# EAGLE schematic cam (EAGLE 9.6.2)
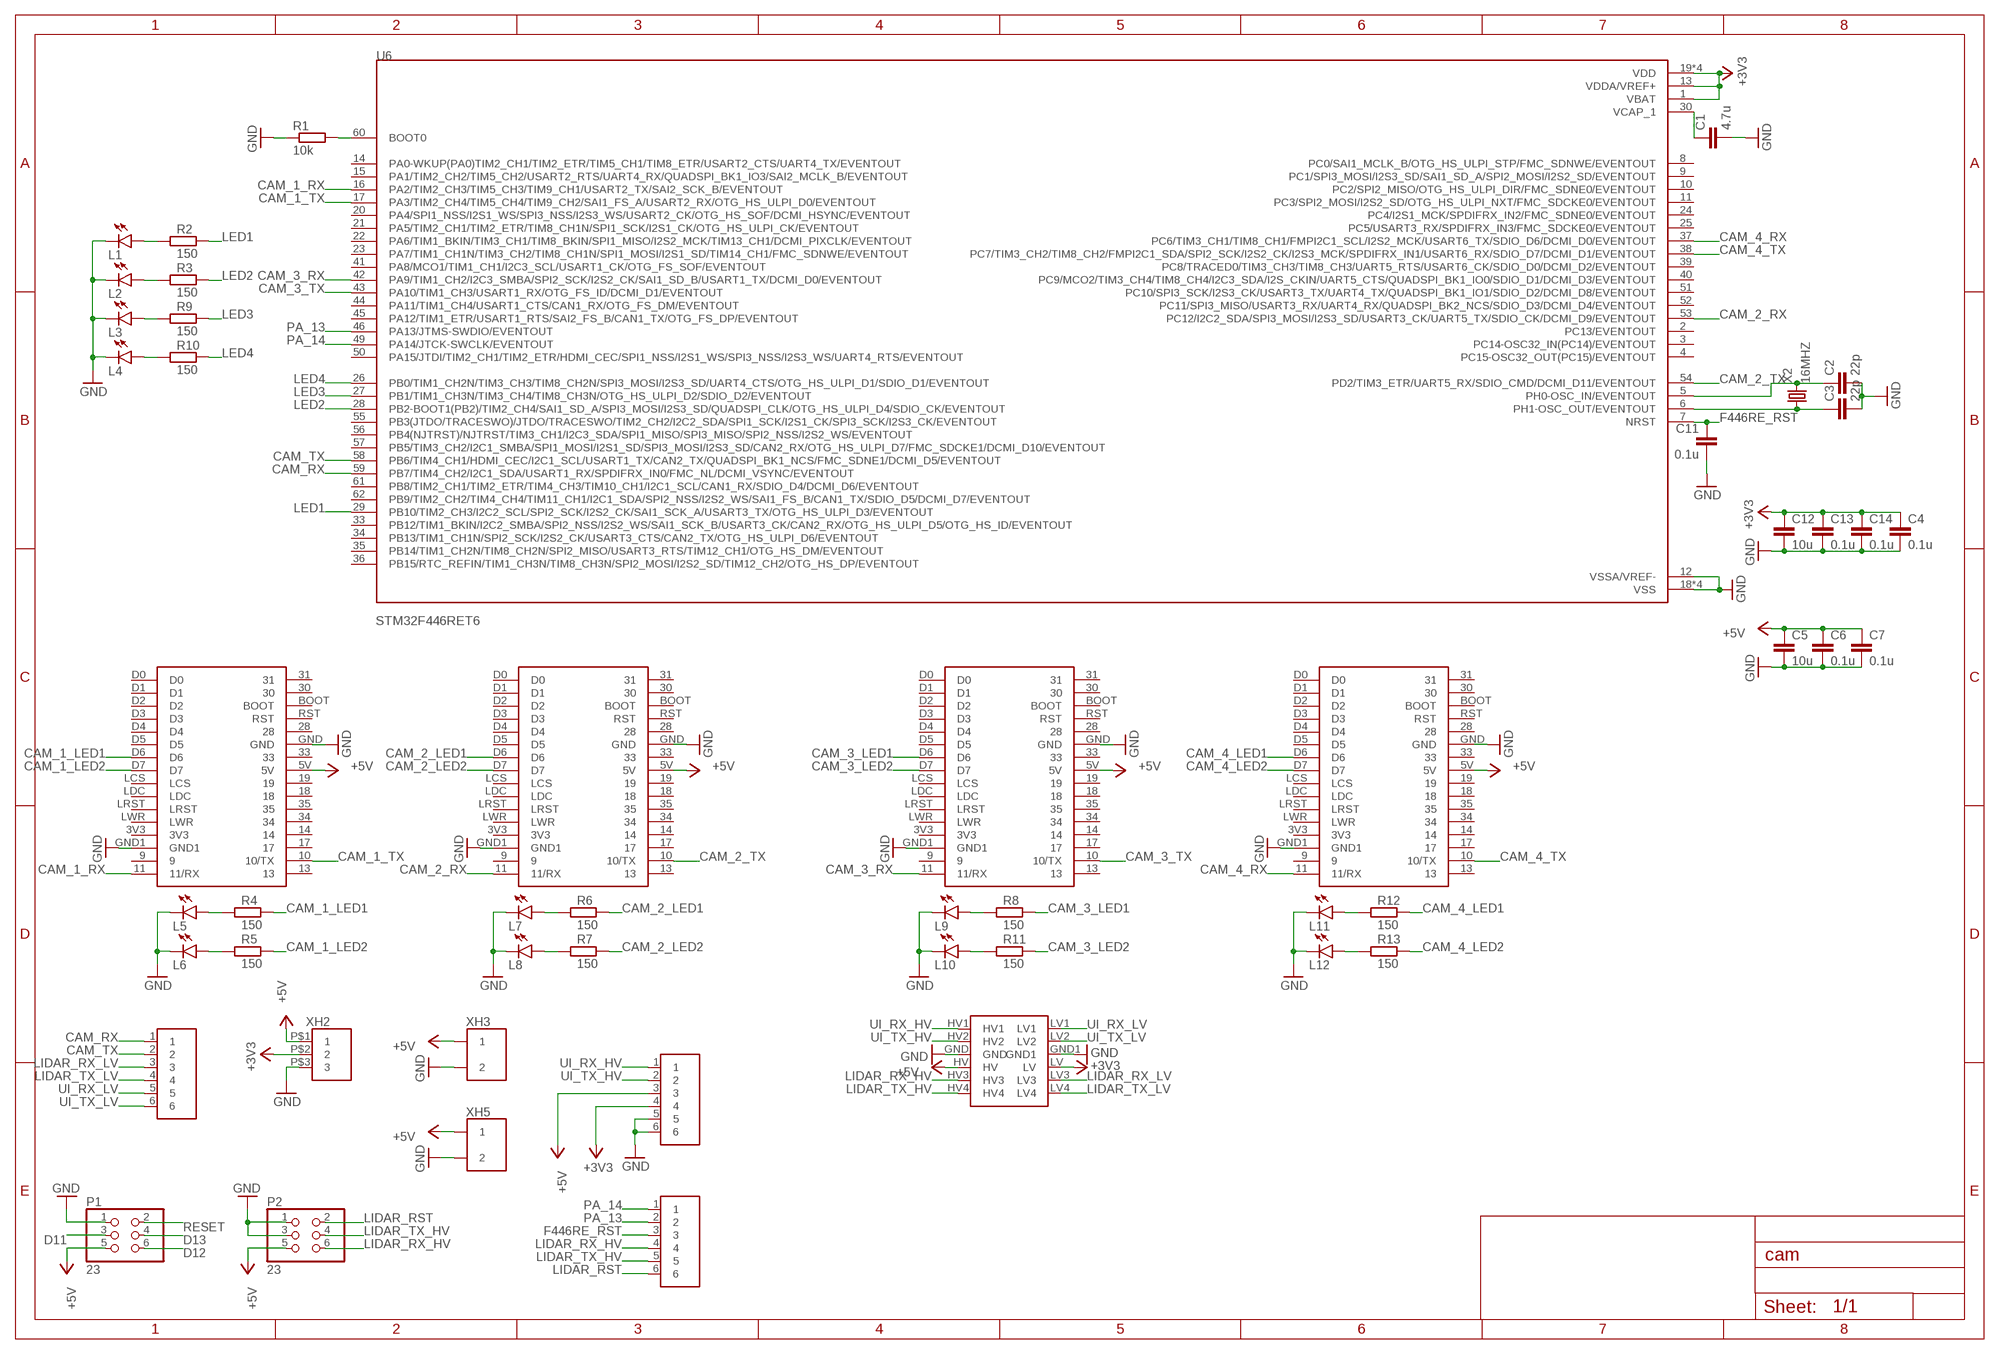
[diagram p0: schematic, sheet 1]

## Parts
C1  4.7u  C-EUC0603  [C0603]
C2  22p  C-EUC0603  [C0603]
C3  22p  C-EUC0603  [C0603]
C4  0.1u  C-EUC0603  [C0603]
C5  10u  C-EUC0805  [C0805]
C6  0.1u  C-EUC0603  [C0603]
C7  0.1u  C-EUC0603  [C0603]
C11  0.1u  C-EUC0603  [C0603]
C12  10u  C-EUC0805  [C0805]
C13  0.1u  C-EUC0603  [C0603]
C14  0.1u  C-EUC0603  [C0603]
L1  SML-E12P8WT86  [LED_SML-LXFM0603SIC-TR]
L2  SML-E12P8WT86  [LED_SML-LXFM0603SIC-TR]
L3  SML-E12P8WT86  [LED_SML-LXFM0603SIC-TR]
L4  SML-E12P8WT86  [LED_SML-LXFM0603SIC-TR]
L5  SML-E12P8WT86  [LED_SML-LXFM0603SIC-TR]
L6  SML-E12P8WT86  [LED_SML-LXFM0603SIC-TR]
L7  SML-E12P8WT86  [LED_SML-LXFM0603SIC-TR]
L8  SML-E12P8WT86  [LED_SML-LXFM0603SIC-TR]
L9  SML-E12P8WT86  [LED_SML-LXFM0603SIC-TR]
L10  SML-E12P8WT86  [LED_SML-LXFM0603SIC-TR]
L11  SML-E12P8WT86  [LED_SML-LXFM0603SIC-TR]
L12  SML-E12P8WT86  [LED_SML-LXFM0603SIC-TR]
P1  23  [2*3]
P2  23  [2*3]
Q1  BSS138  [BSS138]
R1  10k  R-EU_R0603  [R0603]
R2  150  R-EU_R0603  [R0603]
R3  150  R-EU_R0603  [R0603]
R4  150  R-EU_R0603  [R0603]
R5  150  R-EU_R0603  [R0603]
R6  150  R-EU_R0603  [R0603]
R7  150  R-EU_R0603  [R0603]
R8  150  R-EU_R0603  [R0603]
R9  150  R-EU_R0603  [R0603]
R10  150  R-EU_R0603  [R0603]
R11  150  R-EU_R0603  [R0603]
R12  150  R-EU_R0603  [R0603]
R13  150  R-EU_R0603  [R0603]
U1  M1N  [M1N]
U2  M1N  [M1N]
U3  M1N  [M1N]
U4  M1N  [M1N]
U6  STM32F446RET6  [QFP50P1200X1200X160-64N]
X2  16MHZ  [16MHZ]
XH1  6B  [6B]
XH2  3B  [3B]
XH3  2B  [2B]
XH4  6B  [6B]
XH5  2B  [2B]
XH6  6B  [6B]

## Nets
+3V3: C4.1 C12.1 C13.1 C14.1 Q1.LV U6.1(VBAT) U6.13(VDDA/VREF+) U6.19(VDD) U6.32(VDD) U6.48(VDD) U6.64(VDD) XH2.P$2 XH4.4
+5V: C5.1 C6.1 C7.1 P1.5 P2.5 Q1.HV U1.5V U2.5V U3.5V U4.5V XH2.P$1 XH3.P$1 XH4.3 XH5.P$1
CAM_1_LED1: R4.2 U1.D6
CAM_1_LED2: R5.2 U1.D7
CAM_1_RX: U1.11(11/RX) U6.16(PA2/TIM2_CH3/TIM5_CH3/TIM9_CH1/USART2_TX/SAI2_SCK_B/EVENTOUT)
CAM_1_TX: U1.10(10/TX) U6.17(PA3/TIM2_CH4/TIM5_CH4/TIM9_CH2/SAI1_FS_A/USART2_RX/OTG_HS_ULPI_D0/EVENTOUT)
CAM_2_LED1: R6.2 U2.D6
CAM_2_LED2: R7.2 U2.D7
CAM_2_RX: U2.11(11/RX) U6.53(PC12/I2C2_SDA/SPI3_MOSI/I2S3_SD/USART3_CK/UART5_TX/SDIO_CK/DCMI_D9/EVENTOUT)
CAM_2_TX: U2.10(10/TX) U6.54(PD2/TIM3_ETR/UART5_RX/SDIO_CMD/DCMI_D11/EVENTOUT)
CAM_3_LED1: R8.2 U3.D6
CAM_3_LED2: R11.2 U3.D7
CAM_3_RX: U3.11(11/RX) U6.42(PA9/TIM1_CH2/I2C3_SMBA/SPI2_SCK/I2S2_CK/SAI1_SD_B/USART1_TX/DCMI_D0/EVENTOUT)
CAM_3_TX: U3.10(10/TX) U6.43(PA10/TIM1_CH3/USART1_RX/OTG_FS_ID/DCMI_D1/EVENTOUT)
CAM_4_LED1: R12.2 U4.D6
CAM_4_LED2: R13.2 U4.D7
CAM_4_RX: U4.11(11/RX) U6.37(PC6/TIM3_CH1/TIM8_CH1/FMPI2C1_SCL/I2S2_MCK/USART6_TX/SDIO_D6/DCMI_D0/EVENTOUT)
CAM_4_TX: U4.10(10/TX) U6.38(PC7/TIM3_CH2/TIM8_CH2/FMPI2C1_SDA/SPI2_SCK/I2S2_CK/I2S3_MCK/SPDIFRX_IN1/USART6_RX/SDIO_D7/DCMI_D1/EVENTOUT)
CAM_RX: U6.59(PB7/TIM4_CH2/I2C1_SDA/USART1_RX/SPDIFRX_IN0/FMC_NL/DCMI_VSYNC/EVENTOUT) XH1.1
CAM_TX: U6.58(PB6/TIM4_CH1/HDMI_CEC/I2C1_SCL/USART1_TX/CAN2_TX/QUADSPI_BK1_NCS/FMC_SDNE1/DCMI_D5/EVENTOUT) XH1.2
D11: P1.3
D12: P1.6
D13: P1.4
F446RE_RST: C11.1 U6.7(NRST) XH6.3
GND: C1.2 C2.2 C3.2 C4.2 C5.2 C6.2 C7.2 C11.2 C12.2 C13.2 C14.2 L1.C L2.C L3.C L4.C L5.C L6.C L7.C L8.C L9.C L10.C L11.C L12.C P1.1 P2.1 P2.3 Q1.GND Q1.GND1 R1.1 U1.GND U1.GND1 U2.GND U2.GND1 U3.GND U3.GND1 U4.GND U4.GND1 U6.12(VSSA/VREF-) U6.18(VSS) U6.31(VSS) U6.47(VSS) U6.63(VSS) XH2.P$3 XH3.P$2 XH4.5 XH4.6 XH5.P$2
LED1: R2.2 U6.29(PB10/TIM2_CH3/I2C2_SCL/SPI2_SCK/I2S2_CK/SAI1_SCK_A/USART3_TX/OTG_HS_ULPI_D3/EVENTOUT)
LED2: R3.2 U6.28(PB2-BOOT1(PB2)/TIM2_CH4/SAI1_SD_A/SPI3_MOSI/I2S3_SD/QUADSPI_CLK/OTG_HS_ULPI_D4/SDIO_CK/EVENTOUT)
LED3: R9.2 U6.27(PB1/TIM1_CH3N/TIM3_CH4/TIM8_CH3N/OTG_HS_ULPI_D2/SDIO_D2/EVENTOUT)
LED4: R10.2 U6.26(PB0/TIM1_CH2N/TIM3_CH3/TIM8_CH2N/SPI3_MOSI/I2S3_SD/UART4_CTS/OTG_HS_ULPI_D1/SDIO_D1/EVENTOUT)
LIDAR_RST: P2.2 XH6.6
LIDAR_RX_HV: P2.6 Q1.HV3 XH6.4
LIDAR_RX_LV: Q1.LV3 XH1.3
LIDAR_TX_HV: P2.4 Q1.HV4 XH6.5
LIDAR_TX_LV: Q1.LV4 XH1.4
N$1: C1.1 U6.30(VCAP_1)
N$2: R1.2 U6.60(BOOT0)
N$3: C2.1 U6.5(PH0-OSC_IN/EVENTOUT) X2.P$2
N$4: C3.1 U6.6(PH1-OSC_OUT/EVENTOUT) X2.P$1
N$5: L2.A R3.1
N$6: L4.A R10.1
N$7: L1.A R2.1
N$8: L6.A R5.1
N$9: L3.A R9.1
N$10: L5.A R4.1
N$11: L8.A R7.1
N$12: L7.A R6.1
N$13: L10.A R11.1
N$14: L9.A R8.1
N$15: L12.A R13.1
N$16: L11.A R12.1
PA_13: U6.46(PA13/JTMS-SWDIO/EVENTOUT) XH6.2
PA_14: U6.49(PA14/JTCK-SWCLK/EVENTOUT) XH6.1
RESET: P1.2
UI_RX_HV: Q1.HV1 XH4.1
UI_RX_LV: Q1.LV1 XH1.5
UI_TX_HV: Q1.HV2 XH4.2
UI_TX_LV: Q1.LV2 XH1.6
Unconnected: U1.3V3 U1.9 U1.13 U1.14 U1.17 U1.18 U1.19 U1.28 U1.30 U1.31 U1.33 U1.34 U1.35 U1.BOOT U1.D0 U1.D1 U1.D2 U1.D3 U1.D4 U1.D5 U1.LCS U1.LDC U1.LRST U1.LWR U1.RST U2.3V3 U2.9 U2.13 U2.14 U2.17 U2.18 U2.19 U2.28 U2.30 U2.31 U2.33 U2.34 U2.35 U2.BOOT U2.D0 U2.D1 U2.D2 U2.D3 U2.D4 U2.D5 U2.LCS U2.LDC U2.LRST U2.LWR U2.RST U3.3V3 U3.9 U3.13 U3.14 U3.17 U3.18 U3.19 U3.28 U3.30 U3.31 U3.33 U3.34 U3.35 U3.BOOT U3.D0 U3.D1 U3.D2 U3.D3 U3.D4 U3.D5 U3.LCS U3.LDC U3.LRST U3.LWR U3.RST U4.3V3 U4.9 U4.13 U4.14 U4.17 U4.18 U4.19 U4.28 U4.30 U4.31 U4.33 U4.34 U4.35 U4.BOOT U4.D0 U4.D1 U4.D2 U4.D3 U4.D4 U4.D5 U4.LCS U4.LDC U4.LRST U4.LWR U4.RST U6.2(PC13/EVENTOUT) U6.3(PC14-OSC32_IN(PC14)/EVENTOUT) U6.4(PC15-OSC32_OUT(PC15)/EVENTOUT) U6.8(PC0/SAI1_MCLK_B/OTG_HS_ULPI_STP/FMC_SDNWE/EVENTOUT) U6.9(PC1/SPI3_MOSI/I2S3_SD/SAI1_SD_A/SPI2_MOSI/I2S2_SD/EVENTOUT) U6.10(PC2/SPI2_MISO/OTG_HS_ULPI_DIR/FMC_SDNE0/EVENTOUT) U6.11(PC3/SPI2_MOSI/I2S2_SD/OTG_HS_ULPI_NXT/FMC_SDCKE0/EVENTOUT) U6.14(PA0-WKUP(PA0)TIM2_CH1/TIM2_ETR/TIM5_CH1/TIM8_ETR/USART2_CTS/UART4_TX/EVENTOUT) U6.15(PA1/TIM2_CH2/TIM5_CH2/USART2_RTS/UART4_RX/QUADSPI_BK1_IO3/SAI2_MCLK_B/EVENTOUT) U6.20(PA4/SPI1_NSS/I2S1_WS/SPI3_NSS/I2S3_WS/USART2_CK/OTG_HS_SOF/DCMI_HSYNC/EVENTOUT) U6.21(PA5/TIM2_CH1/TIM2_ETR/TIM8_CH1N/SPI1_SCK/I2S1_CK/OTG_HS_ULPI_CK/EVENTOUT) U6.22(PA6/TIM1_BKIN/TIM3_CH1/TIM8_BKIN/SPI1_MISO/I2S2_MCK/TIM13_CH1/DCMI_PIXCLK/EVENTOUT) U6.23(PA7/TIM1_CH1N/TIM3_CH2/TIM8_CH1N/SPI1_MOSI/I2S1_SD/TIM14_CH1/FMC_SDNWE/EVENTOUT) U6.24(PC4/I2S1_MCK/SPDIFRX_IN2/FMC_SDNE0/EVENTOUT) U6.25(PC5/USART3_RX/SPDIFRX_IN3/FMC_SDCKE0/EVENTOUT) U6.33(PB12/TIM1_BKIN/I2C2_SMBA/SPI2_NSS/I2S2_WS/SAI1_SCK_B/USART3_CK/CAN2_RX/OTG_HS_ULPI_D5/OTG_HS_ID/EVENTOUT) U6.34(PB13/TIM1_CH1N/SPI2_SCK/I2S2_CK/USART3_CTS/CAN2_TX/OTG_HS_ULPI_D6/EVENTOUT) U6.35(PB14/TIM1_CH2N/TIM8_CH2N/SPI2_MISO/USART3_RTS/TIM12_CH1/OTG_HS_DM/EVENTOUT) U6.36(PB15/RTC_REFIN/TIM1_CH3N/TIM8_CH3N/SPI2_MOSI/I2S2_SD/TIM12_CH2/OTG_HS_DP/EVENTOUT) U6.39(PC8/TRACED0/TIM3_CH3/TIM8_CH3/UART5_RTS/USART6_CK/SDIO_D0/DCMI_D2/EVENTOUT) U6.40(PC9/MCO2/TIM3_CH4/TIM8_CH4/I2C3_SDA/I2S_CKIN/UART5_CTS/QUADSPI_BK1_IO0/SDIO_D1/DCMI_D3/EVENTOUT) U6.41(PA8/MCO1/TIM1_CH1/I2C3_SCL/USART1_CK/OTG_FS_SOF/EVENTOUT) U6.44(PA11/TIM1_CH4/USART1_CTS/CAN1_RX/OTG_FS_DM/EVENTOUT) U6.45(PA12/TIM1_ETR/USART1_RTS/SAI2_FS_B/CAN1_TX/OTG_FS_DP/EVENTOUT) U6.50(PA15/JTDI/TIM2_CH1/TIM2_ETR/HDMI_CEC/SPI1_NSS/I2S1_WS/SPI3_NSS/I2S3_WS/UART4_RTS/EVENTOUT) U6.51(PC10/SPI3_SCK/I2S3_CK/USART3_TX/UART4_TX/QUADSPI_BK1_IO1/SDIO_D2/DCMI_D8/EVENTOUT) U6.52(PC11/SPI3_MISO/USART3_RX/UART4_RX/QUADSPI_BK2_NCS/SDIO_D3/DCMI_D4/EVENTOUT) U6.55(PB3(JTDO/TRACESWO)/JTDO/TRACESWO/TIM2_CH2/I2C2_SDA/SPI1_SCK/I2S1_CK/SPI3_SCK/I2S3_CK/EVENTOUT) U6.56(PB4(NJTRST)/NJTRST/TIM3_CH1/I2C3_SDA/SPI1_MISO/SPI3_MISO/SPI2_NSS/I2S2_WS/EVENTOUT) U6.57(PB5/TIM3_CH2/I2C1_SMBA/SPI1_MOSI/I2S1_SD/SPI3_MOSI/I2S3_SD/CAN2_RX/OTG_HS_ULPI_D7/FMC_SDCKE1/DCMI_D10/EVENTOUT) U6.61(PB8/TIM2_CH1/TIM2_ETR/TIM4_CH3/TIM10_CH1/I2C1_SCL/CAN1_RX/SDIO_D4/DCMI_D6/EVENTOUT) U6.62(PB9/TIM2_CH2/TIM4_CH4/TIM11_CH1/I2C1_SDA/SPI2_NSS/I2S2_WS/SAI1_FS_B/CAN1_TX/SDIO_D5/DCMI_D7/EVENTOUT)

## Library data of the parts
C1-C7 C11-C14 = rcl:C-EU: CAPACITOR, European symbol; SPICEPREFIX: C
L1-L12 = LED:SML-E12P8WT86
P1 P2 = pin_socket:2*3
Q1 = logic_level:BSS138
R1-R13 = rcl:R-EU_: RESISTOR, European symbol; SPICEPREFIX: R
U1-U4 = sipeed:M1N
U6 = STM32F446RET6:STM32F446RET6: MCU 32-Bit STM32 ARM Cortex M4 RISC 512KB Flash 2.5V/3.3V 64-Pin LQFP Tray Check availability <https://pricing.snapeda.com/parts/STM32F446RET6/STMicroelectronics/view-part?ref=eda>; AVAILABILITY: In Stock; DESCRIPTION: ARM® Cortex®-M4 STM32F4 Microcontroller IC 32-Bit Single-Core 180MHz 512KB (512K x 8) FLASH 64-LQFP (10x10); MF: STMicroelectronics; MP: STM32F446RET6; PACKAGE: LQFP-64 STMicroelectronics; PRICE: None; PURCHASE-URL: https://pricing.snapeda.com/search/part/STM32F446RET6/?ref=eda
X2 = crystal:16MHZ
XH1 XH4 XH6 = XH:6B
XH2 = XH:3B
XH3 XH5 = XH:2B